# EAGLE design Expander2 (EAGLE 6.3)
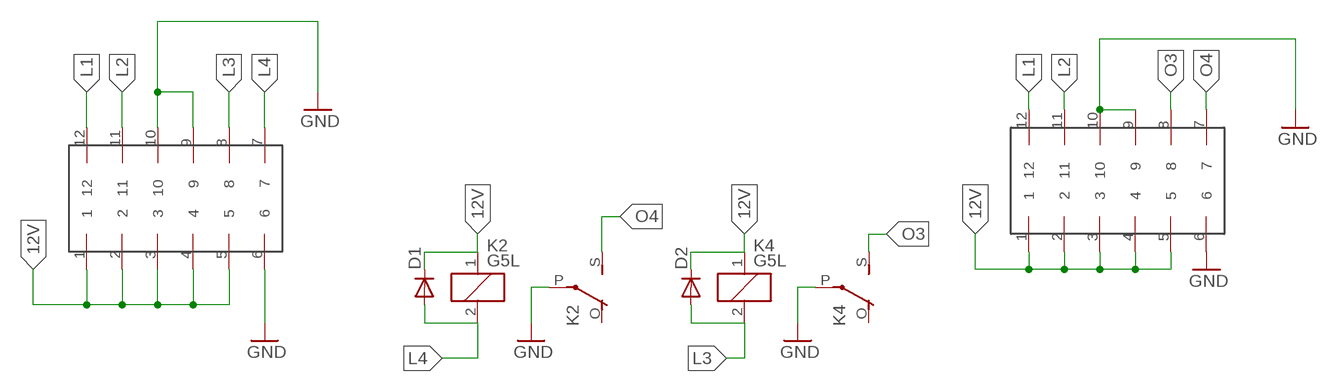
[diagram p0: schematic, sheet 1]

## Parts
D1  DIODESMB  [SMB-DIODE]
D2  DIODESMB  [SMB-DIODE]
IN  MF42-10  [MF42-10]
K2  G5L  [G5LE]
K4  G5L  [G5LE]
OUT  MF42-10  [MF42-10]

## Nets
12V: D1.C D2.C IN.1 IN.2 IN.3 IN.4 IN.5 K2.1 K4.1 OUT.1 OUT.2 OUT.3 OUT.4 OUT.5
GND: IN.6 IN.9 IN.10 K2.P(2:P) K4.P(2:P) OUT.6 OUT.9 OUT.10
L1: IN.12 OUT.12
L2: IN.11 OUT.11
L3: D2.A IN.8 K4.2
L4: D1.A IN.7 K2.2
O3: K4.S(2:S) OUT.8
O4: K2.S(2:S) OUT.7
Unconnected: K2.O(2:O) K4.O(2:O)

## Library data of the parts
D1 D2 = SparkFun-DiscreteSemi:DIODE: Diode These are standard reverse protection diodes and small signal diodes. SMA package can handle up to about 1A. SOD-323 can handle about 200mA. What the SOD-323 package when ordering, there are some mfgs out there that are 5-pin packages.
IN OUT = con-amphenol:MF42-10
K2 K4 = relay:G5L: RELAY 1 x switch, 10 A/120 V AC, 8 A/30 V ADC, Omron; OC_FARNELL: unknown; OC_NEWARK: unknown

## Board
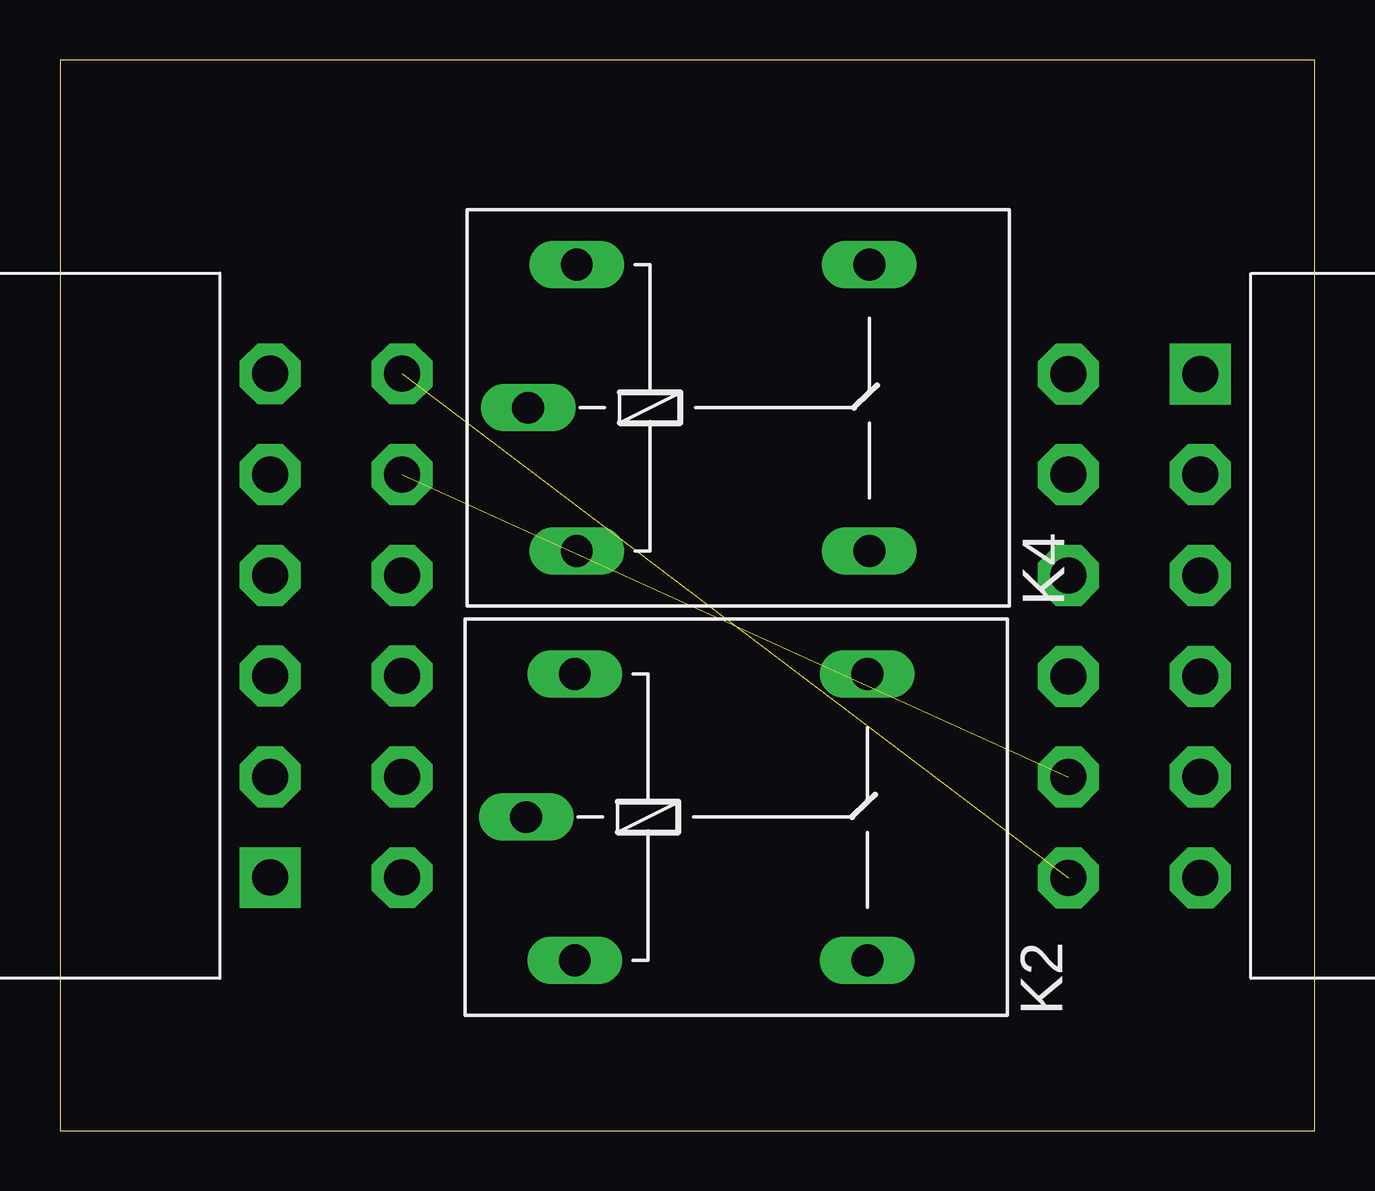
[diagram p1: board, top side]
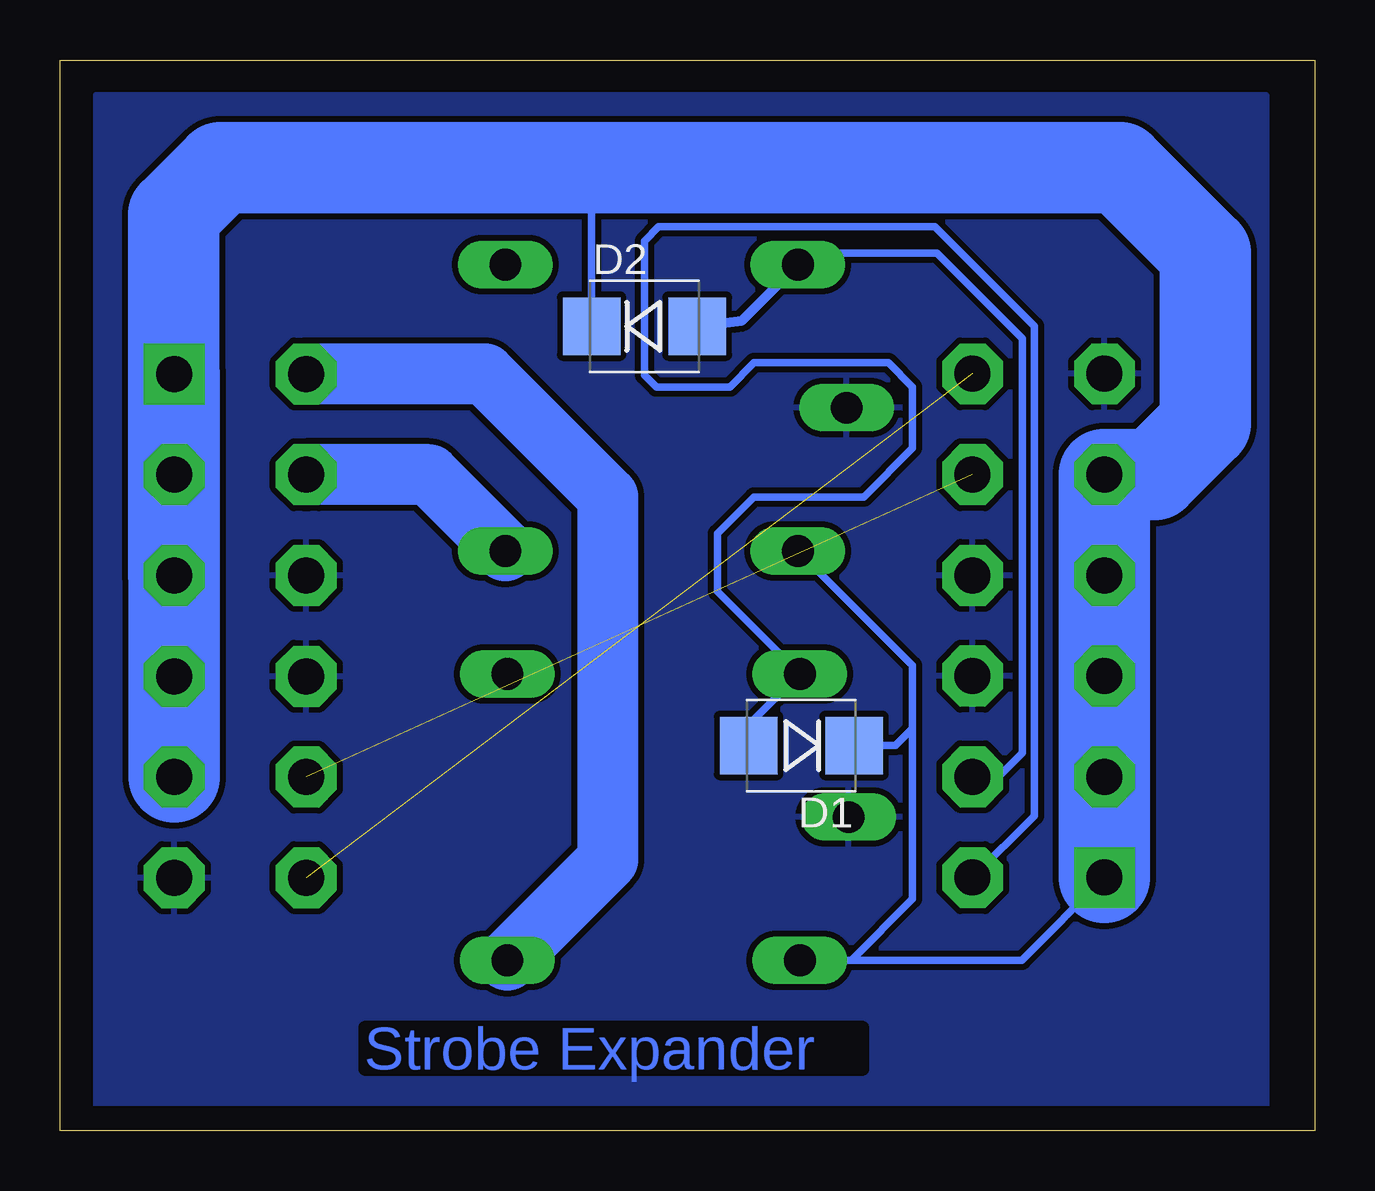
[diagram p2: board, bottom side, seen from below]

Size 52.3 x 44.63 mm. Coordinates in mm from the lower left corner, seen from the top.
Outline: 0,0 52.3,0 52.3,44.63 0,44.63 0,0
Copper layers (1*16): Top 0.035mm / dielectric 1.5mm / Bottom 0.035mm
Design rules "default": minimum track width 10mil, minimum drill 24mil, track to track 8mil, track to pad 8mil, pad to pad 8mil, via to via 8mil, smd to smd 8mil, copper to edge 40mil, drill to drill 8mil, minimum pad ring 10mil, minimum via ring 8mil, stop-mask expansion 4mil, vias tented up to drill 0mil, thermal gap 10mil

### Footprints (pad centres in the part's own frame; a part is rotated, then mirrored left to right if it is on the bottom)
SMB-DIODE = smd 2.4 x 2.4: A 2.2,0; C -2.2,0
MF42-10 = drill 1.5 pad 2.54 square: 1 16.8,0 | drill 1.5 pad 2.54 octagon: 2 12.6,0; 3 8.4,0; 4 4.2,0; 5 0,0; 6 -4.2,0; 7 16.8,5.5; 8 12.6,5.5; 9 8.4,5.5; 10 4.2,5.5; 11 0,5.5; 12 -4.2,5.5
G5LE = drill 1.321 long: 1 -7.493,-5.969; 2 -7.493,5.969; O 4.699,5.969; P -9.525,0; S 4.699,-5.969

### Placement (x,y rotation side)
D1  21.4,16.05 180 bottom
D2  27.94,33.53 0 bottom
IN  8.76,27.34 270 top
K2  28.96,13.07 0 top
K4  29.04,30.13 0 top
OUT  47.54,14.74 90 top

### Tracks (layer width: path | path; a pad name or v marks a point on that pad's centre or on a via)
12V
  Bottom 0.305: IN.1 12.21,7.1 19.32,7.1 | 19.32,7.1 K2.1 | K4.1 16.76,19.38 16.76,16.76 | 16.76,16.76 16.76,9.65 19.32,7.1 | D2.C 30.14,39.96 29.97,40.13 | D1.C 17.48,16.05 16.76,16.76
  Bottom 3.81: OUT.5 OUT.4 OUT.3 | OUT.3 OUT.2 OUT.1 | OUT.3 47.56,23.16 47.56,38.17 45.6,40.13 29.97,40.13 8.13,40.13 4.57,36.58 4.57,29.46 6.69,27.34 IN.5 IN.4 IN.3 IN.2 IN.1
GND
  pour Bottom (isolate 0.254): 2.03,-0.51 50.8,-0.51 50.8,43.18 2.03,43.18
L1  (1 unrouted)
L2  (1 unrouted)
L3
  Bottom 0.305: IN.8 13.2,14.75 12.19,15.75 12.19,33.02 15.75,36.58 21.07,36.58 K4.2
  Bottom 0.406: D2.A 23.88,33.77 K4.2
L4
  Bottom 0.305: IN.7 11.68,13.12 11.68,33.53 15.83,37.68 27.35,37.68 27.94,37.08 27.94,31.5 27.43,30.99 24.38,30.99 23.37,32 17.78,32 16.76,30.99 16.76,28.45 18.8,26.42 23.37,26.42 24.89,24.89 24.89,22.46 K2.2 | K2.2 21.57,19.04 | D1.A 23.54,16.96 K2.2
O3
  Bottom 2.54: K4.S 36.92,27.34 OUT.8
O4
  Bottom 2.54: K2.S 29.46,11.29 29.46,26.42 34.59,31.54 OUT.7

### Text on the board
Bottom: Strobe Expander